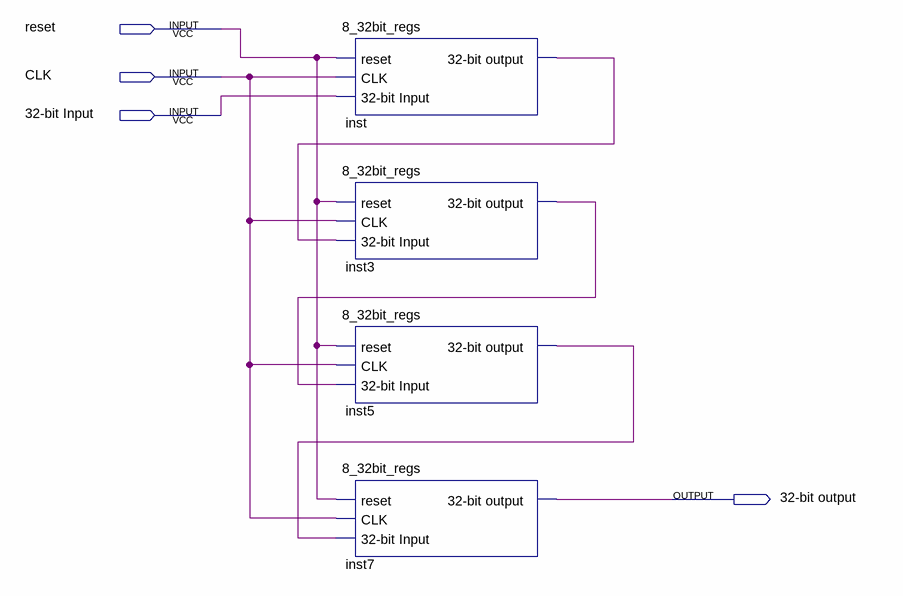
[diagram p0: schematic sheet]
// Quartus schematic 32_32bit_regs.bdf as structural Verilog: 4 symbols, 4 pins
module \32_32bit_regs  (
  input  reset,
  input  CLK,
  input  \32-bit_Input ,
  output \32-bit_output 
);

  wire inst3_32_bit_output, inst5_32_bit_output, inst_32_bit_output;

  \8_32bit_regs  inst (.reset(reset), .CLK(CLK), .\32-bit_Input (\32-bit_Input ), .\32-bit_output (inst_32_bit_output));
  \8_32bit_regs  inst3 (
    .reset(reset), .CLK(CLK), .\32-bit_Input (inst_32_bit_output), .\32-bit_output (inst3_32_bit_output));
  \8_32bit_regs  inst5 (
    .reset(reset), .CLK(CLK), .\32-bit_Input (inst3_32_bit_output), .\32-bit_output (inst5_32_bit_output));
  \8_32bit_regs  inst7 (
    .reset(reset), .CLK(CLK), .\32-bit_Input (inst5_32_bit_output), .\32-bit_output (\32-bit_output ));
endmodule
